# Altium schematic sheet SW1106 100W 单C SH1.SchDoc
size A4; SheetNumber: 1; SheetTotal: 1
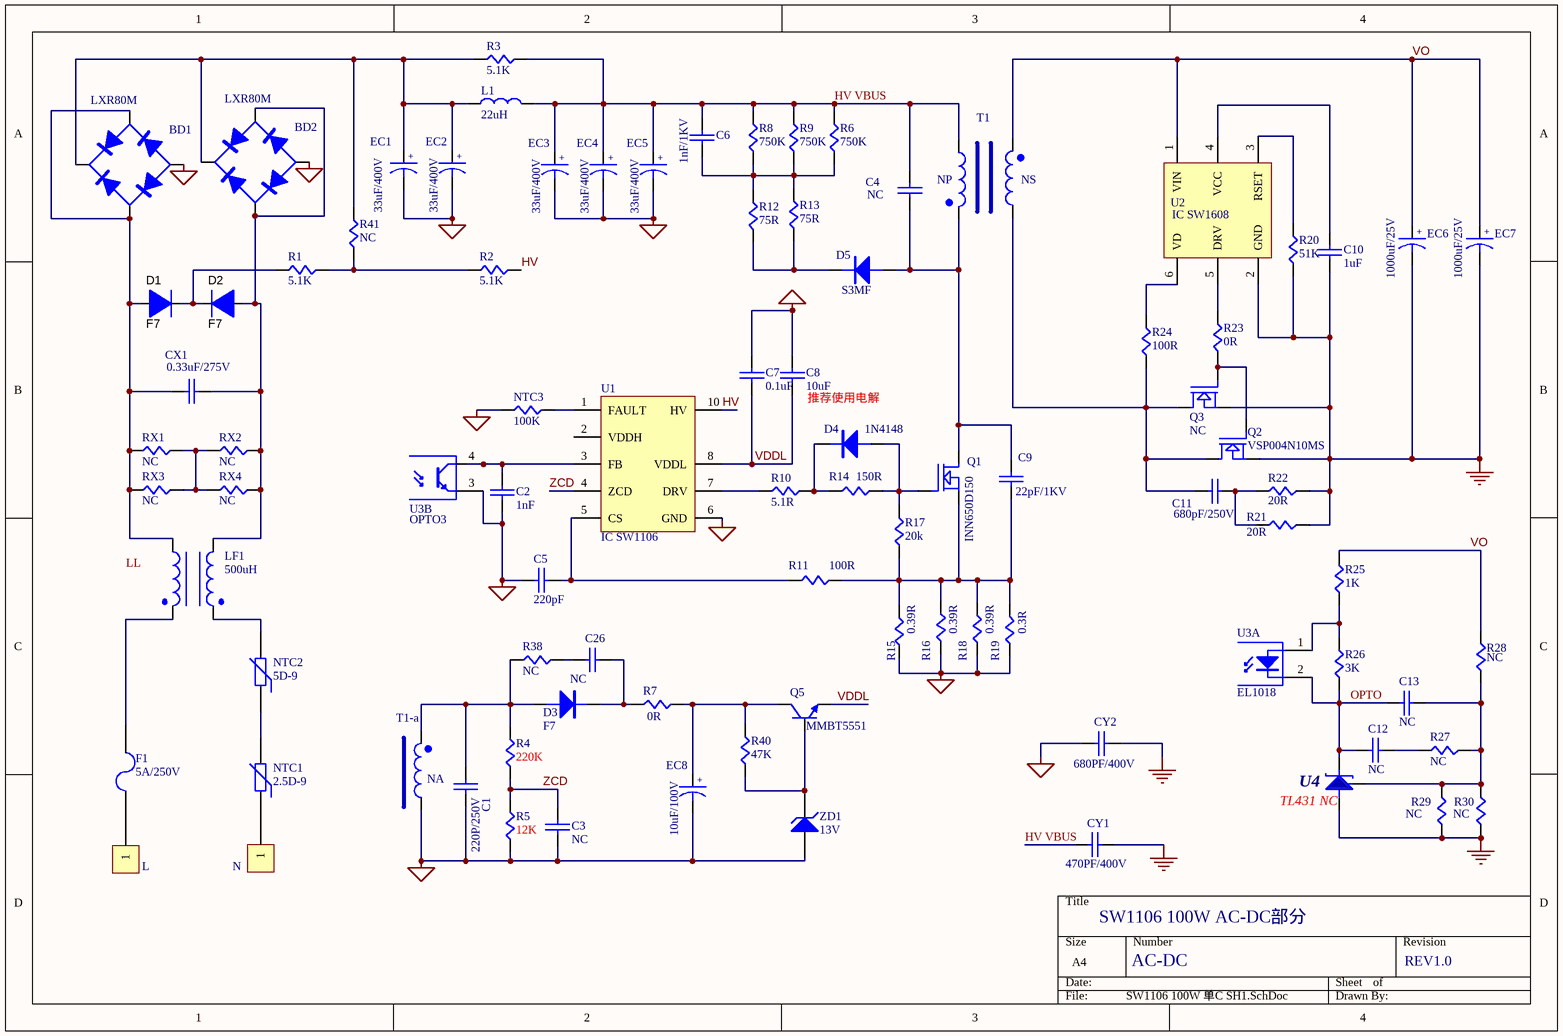
[diagram p0: SW1106 100W 单C SH1.SchDoc]

## Parts
BD1  LXR80M  [BD-MBSL]
BD2  LXR80M  [BD-MBSL]
C1  220P/250V  [0603-C]
C2  1nF  [0603-C]
C3  NC  [0603-C]
C4  NC  [0805_C]
C5  220pF  [0603-C]
C6  1nF/1KV  [1206-C]
C7  0.1uF  [0805_C]
C8  10uF  [1206-C]
C9  22pF/1KV  [1206-C]
C10  1uF  [0603-C]
C11  680pF/250V  [0805_C]
C12  NC  [0603]
C13  NC  [0603]
C26  NC  [0805_C]
CX1  0.33uF/275V  [X-10-CAP - 3]
CY1  470PF/400V  [Y-SMD]
CY2  680PF/400V  [Y-SMD]
D1  F7  [SOD-123H]
D2  F7  [SOD-123H]
D3  F7  [SOD-123F]
D4  1N4148  [SOD-323]
D5  S3MF  [DIODE-S2MB]
EC1  33uF/400V  [CD-8/3.5]
EC2  33uF/400V  [CD-8/3.5]
EC3  33uF/400V  [CD-8/3.5]
EC4  33uF/400V  [CD-8/3.5]
EC5  33uF/400V  [CD-8/3.5]
EC6  1000uF/25V  [CD-6.3/2.3]
EC7  1000uF/25V  [CD-6.3/2.3]
EC8  10uF/100V  [CD-8/3.5]
F1  5A/250V  [F-8.5*4-P5]
L  L  [焊盘1.5mm]  (value not drawn)
L1  22uH  [LF-D8-P5]
LF1  500uH  [LF-9X3.2]
N  N  [焊盘1.5mm]  (value not drawn)
NS  (no value)
NTC1  2.5D-9  [5D9]
NTC2  5D-9  [5D9]
NTC3  100K  [0603-R]
Q1  INN650D150  [TO220-GDS]
Q2  VSP004N10MS  [TO220-GDS]
Q3  NC  [TO220-GDS]
Q5  MMBT5551  [SOT-23]
R1  5.1K  [1206-R]
R2  5.1K  [1206-R]
R3  5.1K  [1206-R]
R4  220K  [0603-R]
R5  12K  [0603-R]
R6  750K  [1206-R]
R7  0R  [0805-R]
R8  750K  [1206-R]
R9  750K  [1206-R]
R10  5.1R  [0603-R]
R11  100R  [0603-R]
R12  75R  [1206-R]
R13  75R  [1206-R]
R14  150R  [0603-R]
R15  0.39R  [1206-R]
R16  0.39R  [1206-R]
R17  20k  [0603-R]
R18  0.39R  [1206-R]
R19  0.3R  [1206-R]
R20  51K  [0603-R]
R21  20R  [0805-R]
R22  20R  [0805-R]
R23  0R  [0603-R]
R24  100R  [0603-R]
R25  1K  [0603-R]
R26  3K  [0603-R]
R27  NC  [0603]
R28  NC  [0603]
R29  NC  [0603]
R30  NC  [0603]
R38  NC  [0603-R]
R40  47K  [0805-R]
R41  NC  [1206-R]
RX1  NC  [1206-R]
RX2  NC  [1206-R]
RX3  NC  [1206-R]
RX4  NC  [1206-R]
T1  NP
T1-a  NA
U1  IC SW1106
U2  IC SW1608  [SOT23-6]
U3  EL1018  [EL1019]  (parts A,B of 2)
U4  TL431 NC  [TL431]
ZD1  13V  [DO-41]

## Nets
GND: C10.2 CY1.1 CY2.1 EC6.2 EC7.2 Q2.S Q3.S R20.1 R21.1 R22.1 R29.2 R30.1 U2.2(GND) U4.A
PGND: BD1.4 BD2.4 C1.2 C2.2 C3.2 C5.2 C7.1 C8.2 CY2.2 EC1.2 EC2.2 EC3.2 EC4.2 EC5.2 EC8.2 NTC3.2 R5.2 R15.1 R16.1 R18.1 R19.1 T1-a.1 U1.6(GND) U3.3 ZD1.1(A)
HV: R2.2 U1.10(HV)
HV VBUS: C4.1 C6.1 CY1.2 EC3.1 EC4.1 EC5.1 L1.1 R3.1 R6.2 R8.2 R9.2 T1.1
OPTO: C12.2 C13.2 R26.2 U3.2 U4.K
VDDL: C7.2 C8.1 Q5.3(E) U1.8(VDDL)
VO: EC6.1 EC7.1 NS.2 R25.1 R28.2 U2.1(VIN)
ZCD: C3.1 R4.2 R5.1 U1.4(ZCD)
NetBD1_1: BD1.1 BD2.1 EC1.1 EC2.1 L1.2 R3.2 R41.2
NetBD1_2: BD1.2 BD1.3 CX1.2 D1.2(A) LF1.3 RX1.1 RX3.1
NetBD2_2: BD2.2 BD2.3 CX1.1 D2.2(A) LF1.4 RX2.2 RX4.2
NetC1_1: C1.1 D3.1(A) R4.1 R38.1 T1-a.2
NetC2_1: C2.1 U1.3(FB) U3.4
NetC4_2: C4.2 C9.1 D5.1(A) Q1.D T1.2
NetC5_1: C5.1 R11.2 U1.5(CS)
NetC6_2: C6.2 R6.1 R8.1 R9.1 R12.2 R13.2
NetC9_2: C9.2 Q1.S R11.1 R15.2 R16.2 R17.2 R18.2 R19.2
NetC10_1: C10.1 U2.4(VCC)
NetC11_1: C11.1 NS.1 Q2.D Q3.D R24.2
NetC11_2: C11.2 R21.2 R22.2
NetC12_1: C12.1 R27.1
NetC13_1: C13.1 R27.2 R28.1 R29.1 R30.2 U4.R
NetC26_1: C26.1 D3.2(K) R7.1
NetC26_2: C26.2 R38.2
NetD1_1: D1.1(K) D2.1(K) R1.1
NetD4_1: D4.1(A) Q1.G R14.1 R17.1
NetD4_2: D4.2(K) R10.1 R14.2
NetD5_2: D5.2(K) R12.1 R13.1
NetEC8_1: EC8.1 Q5.2(C) R7.2 R40.2
NetF1_1: F1.1 LF1.2
NetF1_2: F1.2 L.1
NetLF1_1: LF1.1 NTC2.2
NetN_1: N.1 NTC1.1
NetNTC1_2: NTC1.2 NTC2.1
NetNTC3_1: NTC3.1 U1.1(FAULT)
NetQ2_G: Q2.G Q3.G R23.2
NetQ5_1: Q5.1(B) R40.1 ZD1.2(K)
NetR1_2: R1.2 R2.1 R41.1
NetR10_2: R10.2 U1.7(DRV)
NetR20_2: R20.2 U2.3(RSET)
NetR23_1: R23.1 U2.5(DRV)
NetR24_1: R24.1 U2.6(VD)
NetR25_2: R25.2 R26.1 U3.1
NetRX1_2: RX1.2 RX2.1 RX3.2 RX4.1

Not connected (* = marked no-connect by the designer): U1 2(VDDH)

## Notes on the sheet
- (near C8) 推荐使用电解
- SW1106 100W AC-DC部分
- AC-DC
- REV1.0
- Labels drawn without touching a wire or pin: LL
- (in symbol CAPACITOR POL) +

## Library data of the parts
BD1 BD2 = BRIDGE: Diode
C1-C13 C26 CY1 CY2 = CAP: Capacitor
CX1 = C: 安规电容CHAMPION  X2 / 尺寸：10X5X11mm（长X宽X高） / 脚距：7.5mm
D1 D2 = CSFMT108-HF: 1N4148 SOD323(0805); SymbolVersion: *; PartNumber: *; Manufacturer: *; PackageReference: *; CompType: *; U/M: *; Vf_V: *; Value: *; Value1: *; Value2: *; Io_A: *; Vr_V: *; TJmax_C: *; RJC_CperW: *; MountType: *; Type: *
D3 D4 = DIODE_1: Diode
D5 = DIODE
EC1-EC8 = CAPACITOR POL: Capacitor
F1 = FUSE
L N = CON1: Connector
L1 = L1: inductor
LF1 = LF-4-7: 16.2uH
NS T1 T1-a = INDUCTOR
NTC1 NTC2 = Res Varistor: Varistor (Voltage-Sensitive Resistor); Published: 24-Mar-1999; LatestRevisionDate: 29-May-2009; LatestRevisionNote: IPC-7351 Footprint Added.; PackageVersion: Mar-2003; PackageReference: 6-0805; Publisher: Altium Limited; PackageDescription: Chip Resistor 0805 Case Size; Code_IPC: RESC2012
NTC3 R1-R30 R38 R40 R41 RX1-RX4 = RES2
Q1-Q3 = NMOSFET (Z): SFS06R02UG 60V/3.2mR PDFN5*6 东微
Q5 = NPN: NPN 三极管
U3 = OPTO3: Optoisolator
U4 = IC431
ZD1 = D Zener: 稳压管